# EAGLE design stm32f0-qfp32-devboard (EAGLE 9.6.2)
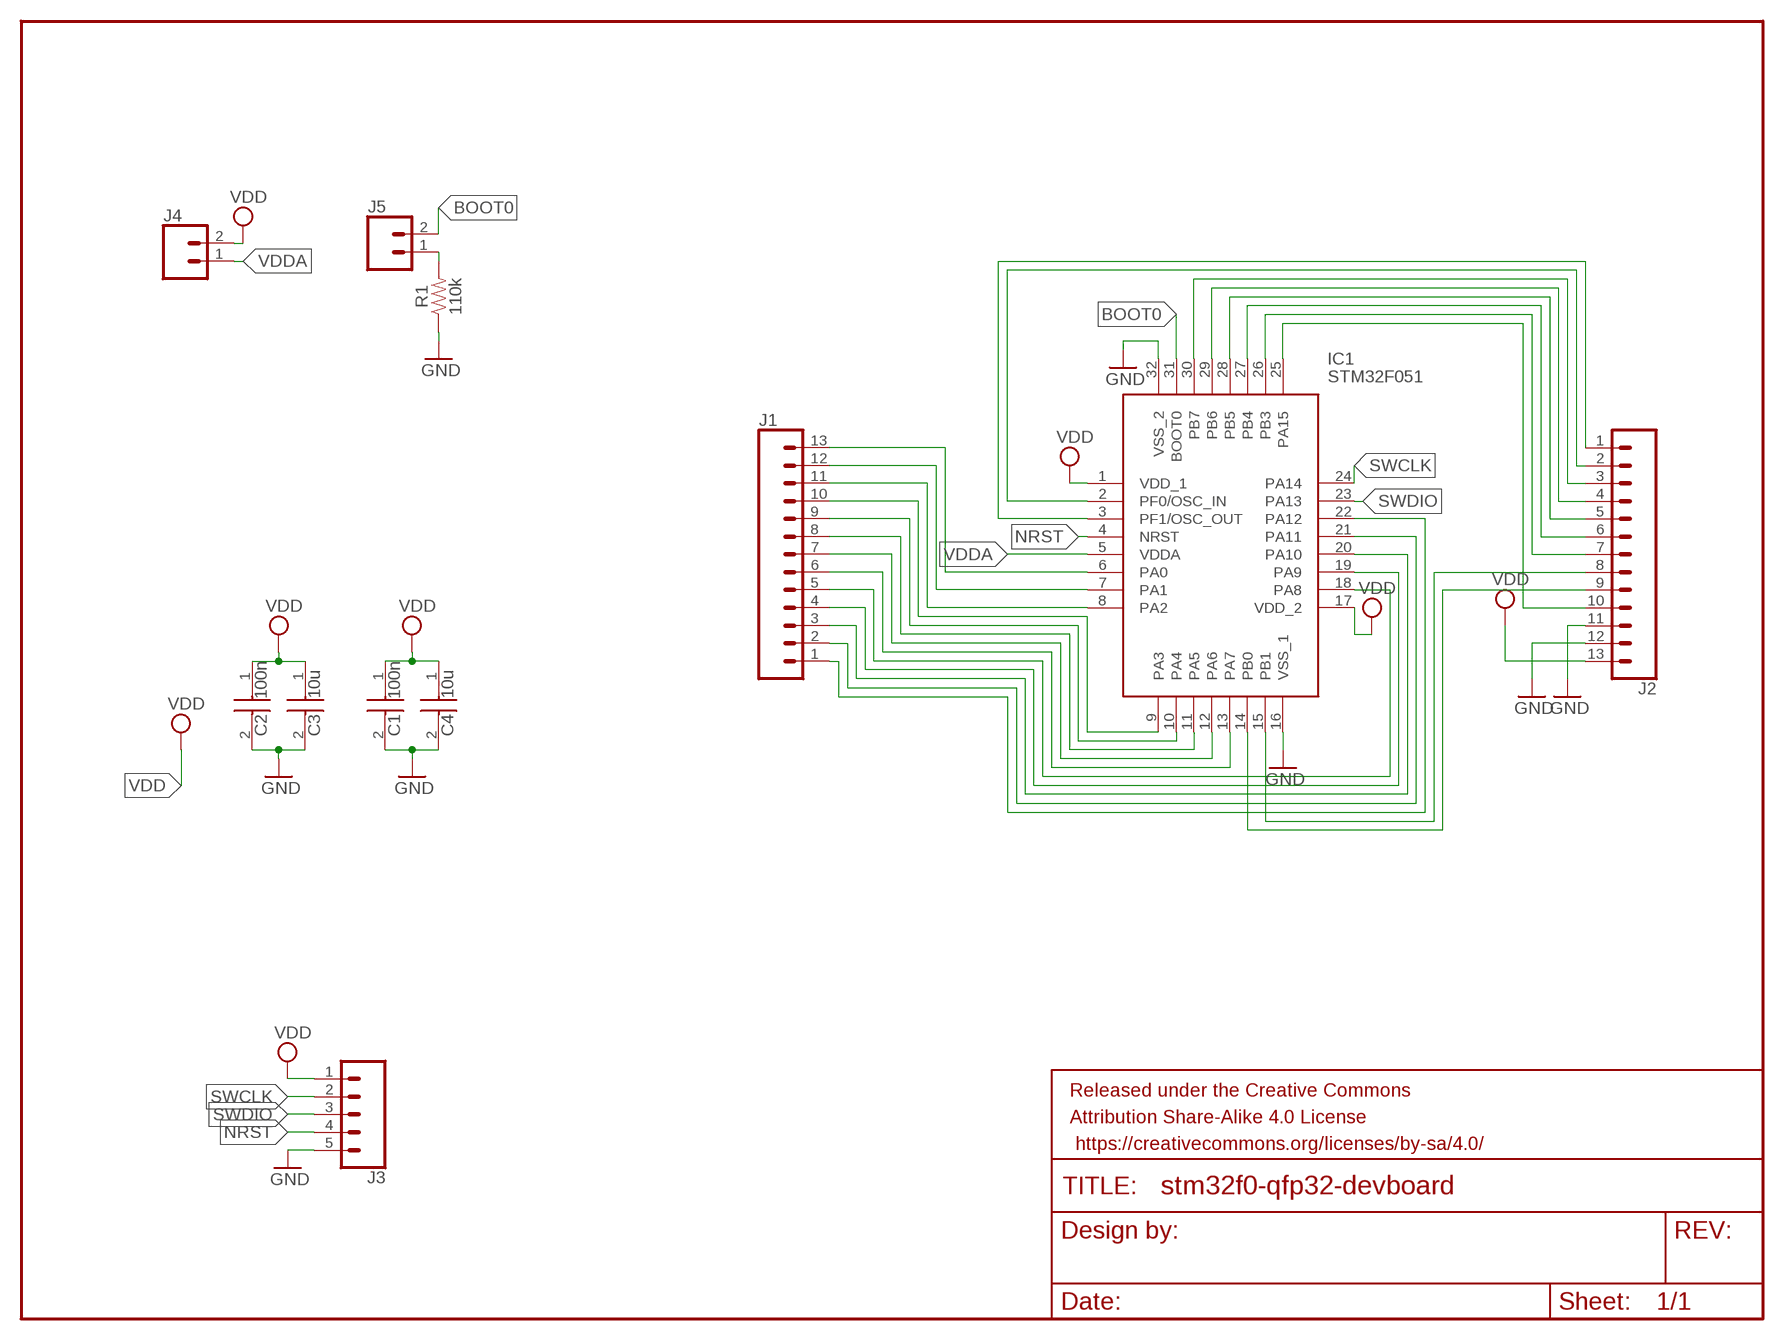
[diagram p0: schematic, sheet 1]

## Parts
C1  100n  C2012X7R1H104K085AA  [CAPC2012X100N]
C2  100n  C2012X7R1H104K085AA  [CAPC2012X100N]
C3  10u  C3216X7R1C106K160AC  [CAPC3216X180N]
C4  10u  C3216X7R1C106K160AC  [CAPC3216X180N]
FRAME2  FRAME-LETTERNO_PACKAGE  [DUMMY]
IC1  STM32F051  STM32F051K8T6  [QFP80P900X900X160-32N]
J1  CONN_13  [1X13]
J2  CONN_13  [1X13]
J3  CONN_05  [1X05]
J4  CONN_02  [1X02]
J5  CONN_02  [1X02]
R1  110k  0.22OHM-0805-1/4W-1%  [0805]

## Nets
BOOT0: IC1.31(BOOT0) J5.2
GND: C1.2 C2.2 C3.2 C4.2 IC1.16(VSS_1) IC1.32(VSS_2) J2.11 J2.12 J3.5 R1.1
N$1: IC1.6(PA0) J1.13
N$2: IC1.7(PA1) J1.12
N$3: IC1.2(PF0/OSC_IN) J2.2
N$4: IC1.3(PF1/OSC_OUT) J2.1
N$5: IC1.30(PB7) J2.3
N$6: IC1.29(PB6) J2.4
N$7: IC1.28(PB5) J2.5
N$8: IC1.27(PB4) J2.6
N$9: IC1.26(PB3) J2.7
N$10: IC1.15(PB1) J2.8
N$11: IC1.14(PB0) J2.9
N$12: IC1.8(PA2) J1.11
N$13: IC1.9(PA3) J1.10
N$14: IC1.10(PA4) J1.9
N$15: IC1.11(PA5) J1.8
N$16: IC1.12(PA6) J1.7
N$17: IC1.13(PA7) J1.6
N$18: IC1.18(PA8) J1.5
N$19: IC1.19(PA9) J1.4
N$20: IC1.20(PA10) J1.3
N$21: IC1.21(PA11) J1.2
N$22: IC1.22(PA12) J1.1
N$23: IC1.25(PA15) J2.10
N$24: J5.1 R1.2
NRST: IC1.4(NRST) J3.4
SWCLK: IC1.24(PA14) J3.2
SWDIO: IC1.23(PA13) J3.3
VDD: C1.1 C2.1 C3.1 C4.1 IC1.1(VDD_1) IC1.17(VDD_2) J2.13 J3.1 J4.2
VDDA: IC1.5(VDDA) J4.1

## Library data of the parts
C1 C2 = C2012X7R1H104K085AA-100n:C2012X7R1H104K085AA: TDK C2012 C 100nF Ceramic Multilayer Capacitor, 50 V dc, +125C, X7R Dielectric, +/-10% SMD Source: Datasheet; DESCRIPTION: TDK C2012 C 100nF Ceramic Multilayer Capacitor, 50 V dc, +125C, X7R Dielectric, +/-10% SMD; HEIGHT: 1mm; MANUFACTURER_NAME: TDK; MANUFACTURER_PART_NUMBER: C2012X7R1H104K085AA; MOUSER_PART_NUMBER: 810-C2012X7R1H104K-2; MOUSER_PRICE-STOCK: https://www.mouser.co.uk/ProductDetail/TDK/C2012X7R1H104K085AA?qs=LcTL%2F5vFEzHdxrAdosNnjw%3D%3D
C3 C4 = C3216X7R1C106K160AC-10u:C3216X7R1C106K160AC: 1206 X7R ceramic capacitor 16V 10uF TDK C3216 C 10uF Ceramic Multilayer Capacitor, 16 V dc X7R Dielectric +/-10% SMD Source: Datasheet <https://product.tdk.com/info/en/catalog/datasheets/mlcc_commercial_midvoltage_en.pdf>; DESCRIPTION: 1206 X7R ceramic capacitor 16V 10uF TDK C3216 C 10uF Ceramic Multilayer Capacitor, 16 V dc X7R Dielectric +/-10% SMD; HEIGHT: 1.8mm; MANUFACTURER_NAME: TDK; MANUFACTURER_PART_NUMBER: C3216X7R1C106K160AC; MOUSER_PART_NUMBER: 810-C3216X7R1C106K; MOUSER_PRICE-STOCK: https://www.mouser.co.uk/ProductDetail/TDK/C3216X7R1C106K160AC?qs=NRhsANhppD%252BpNpcA%252BnoX2A%3D%3D
FRAME2 = SparkFun-Aesthetics:FRAME-LETTER: Schematic Frame - Letter Standard 8.5x11 US Letter frame; DESIGNER: Nobody; VERSION: v01
IC1 = STM32F051:STM32F051K8T6: Source: Datasheet <http://www.st.com/web/en/resource/technical/document/datasheet/DM00039193.pdf>; HEIGHT: 1.6mm; MANUFACTURER_NAME: STMicroelectronics; MANUFACTURER_PART_NUMBER: STM32F051K8T6; MOUSER_PART_NUMBER: 511-STM32F051K8T6; MOUSER_PRICE-STOCK: https://www.mouser.co.uk/ProductDetail/STMicroelectronics/STM32F051K8T6?qs=gNDSiZmRJS8MM9puf%252Bb4Hg%3D%3D
J1 J2 = SparkFun-Connectors:CONN_13: Multi connection point. Often used as Generic Header-pin footprint for 0.1 inch spaced/style header connections On any of the 0.1 inch spaced packages, you can populate with these: Break Away Headers - Straight <https://www.sparkfun.com/products/116> (PRT-00116) Break Away Male Headers - Right Angle <https://www.sparkfun.com/products/553> (PRT-00553) Female Headers <https://www.sparkfun.com/products/115> (PRT-00115) Break Away Headers - Machine Pin <https://www.sparkfun.com/products/117> (PRT-00117) Break Away Female Headers - Swiss Machine Pin <https://www.sparkfun.com/products/743> (PRT-00743) For SCREWTERMINALS and SPRING TERMINALS visit here: Screw Terimnals on SparkFun.com <https://www.sparkfun.com/search/results?term=Screw+Terminals> (5mm/3.5mm/2.54mm spacing) This device is also useful as a general connection point to wire up your design to another part of your project. Our various solder wires solder well into these plated through hole pads. Hook-Up Wire - Assortment (Stranded, 22 AWG) <https://www.sparkfun.com/products/11375> (PRT-11375) Hook-Up Wire - Assortment (Solid Core, 22 AWG) <https://www.sparkfun.com/products/11367> (PRT-11367) View the entire wire category on our website here <https://www.sparkfun.com/categories/141> Special notes: Molex polarized connector foot print use with SKU : PRT-08231 with associated crimp pins and housings. 1MM SMD Version SKU: PRT-10208 NOTES ON THE VARIANTS LOCK and LOCK_LONGPADS... This footprint was designed to help hold the alignment of a through-hole component (i.e. 6-pin header) while soldering it into place. You may notice that each hole has been shifted either up or down by 0.005 of an inch from it's more standard position (which is a perfectly straight line). This slight alteration caused the pins (the squares in the middle) to touch the edges of the holes. Because they are alternating, it causes a "brace" to hold the component in place. 0.005 has proven to be the perfect amount of "off-center" position when using our standard breakaway headers. Although looks a little odd when you look at the bare footprint, once you have a header in there, the alteration is very hard to notice. Also,if you push a header all the way into place, it is covered up entirely on the bottom side.
J3 = SparkFun-Connectors:CONN_05: Multi connection point. Often used as Generic Header-pin footprint for 0.1 inch spaced/style header connections On any of the 0.1 inch spaced packages, you can populate with these: Break Away Headers - Straight <https://www.sparkfun.com/products/116> (PRT-00116) Break Away Male Headers - Right Angle <https://www.sparkfun.com/products/553> (PRT-00553) Female Headers <https://www.sparkfun.com/products/115> (PRT-00115) Break Away Headers - Machine Pin <https://www.sparkfun.com/products/117> (PRT-00117) Break Away Female Headers - Swiss Machine Pin <https://www.sparkfun.com/products/743> (PRT-00743) For SCREWTERMINALS and SPRING TERMINALS visit here: Screw Terimnals on SparkFun.com <https://www.sparkfun.com/search/results?term=Screw+Terminals> (5mm/3.5mm/2.54mm spacing) This device is also useful as a general connection point to wire up your design to another part of your project. Our various solder wires solder well into these plated through hole pads. Hook-Up Wire - Assortment (Stranded, 22 AWG) <https://www.sparkfun.com/products/11375> (PRT-11375) Hook-Up Wire - Assortment (Solid Core, 22 AWG) <https://www.sparkfun.com/products/11367> (PRT-11367) View the entire wire category on our website here <https://www.sparkfun.com/categories/141> Special notes: Molex polarized connector foot print use with SKU : PRT-08231 with associated crimp pins and housings. 1MM SMD Version SKU: PRT-10208
J4 J5 = SparkFun-Connectors:CONN_02: Multi connection point. Often used as Generic Header-pin footprint for 0.1 inch spaced/style header connections On any of the 0.1 inch spaced packages, you can populate with these: Break Away Headers - Straight <https://www.sparkfun.com/products/116> (PRT-00116) Break Away Male Headers - Right Angle <https://www.sparkfun.com/products/553> (PRT-00553) Female Headers <https://www.sparkfun.com/products/115> (PRT-00115) Break Away Headers - Machine Pin <https://www.sparkfun.com/products/117> (PRT-00117) Break Away Female Headers - Swiss Machine Pin <https://www.sparkfun.com/products/743> (PRT-00743) For SCREWTERMINALS and SPRING TERMINALS visit here: Screw Terimnals on SparkFun.com <https://www.sparkfun.com/search/results?term=Screw+Terminals> (5mm/3.5mm/2.54mm spacing) This device is also useful as a general connection point to wire up your design to another part of your project. Our various solder wires solder well into these plated through hole pads. Hook-Up Wire - Assortment (Stranded, 22 AWG) <https://www.sparkfun.com/products/11375> (PRT-11375) Hook-Up Wire - Assortment (Solid Core, 22 AWG) <https://www.sparkfun.com/products/11367> (PRT-11367) View the entire wire category on our website here <https://www.sparkfun.com/categories/141> Special notes: Molex polarized connector foot print use with: PRT-08233 with associated crimp pins and housings. 2.54_SCREWTERM for use with PRT-10571. 3.5mm Screw Terminal footprints for PRT-08084 5mm Screw Terminal footprints for use with PRT-08432
R1 = SparkFun-Resistors:0.22OHM: 0.22Ω resistor A resistor is a passive two-terminal electrical component that implements electrical resistance as a circuit element. Resistors act to reduce current flow, and, at the same time, act to lower voltage levels within circuits. - Wikipedia; PROD_ID: RES-09883; VALUE: 0.22

## Board
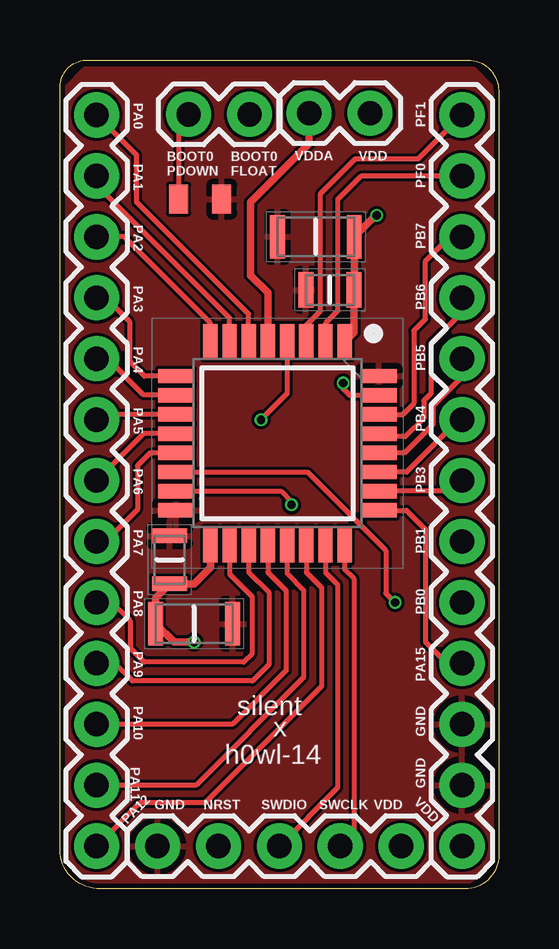
[diagram p1: board, top side]
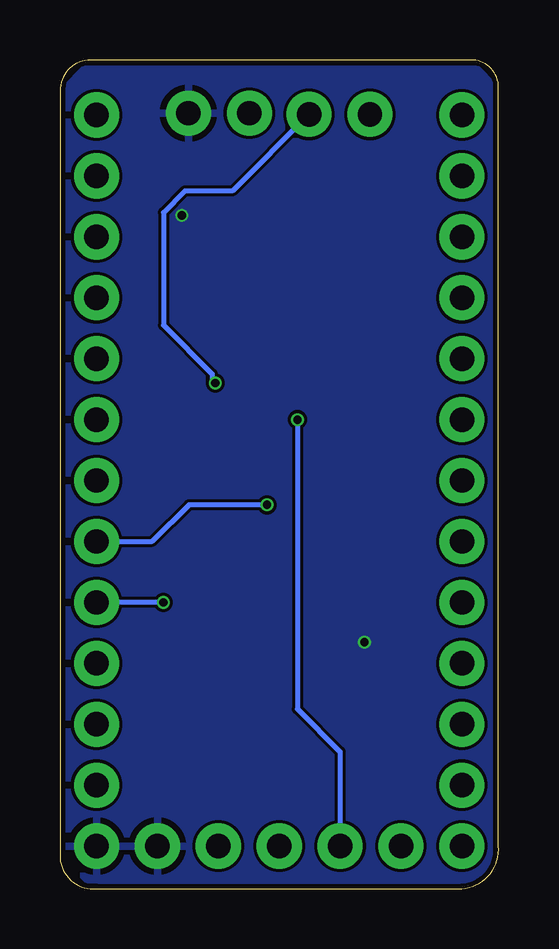
[diagram p2: board, bottom side, seen from below]

Size 18.29 x 34.56 mm. Coordinates in mm from the lower left corner, seen from the top.
Outline: 0,1.78 0,33.53 arc-90 1.27,34.55 17.02,34.55 arc-90 18.29,33.28 18.29,1.28 arc-90 16.77,0.01 1.53,0.01 arc-90 0,1.78
Copper layers (1*16): Top 0.035mm / dielectric 1.5mm / Bottom 0.035mm
Design rules "default *": minimum track width 5mil, minimum drill 12mil, track to track 5mil, track to pad 5mil, pad to pad 5mil, via to via 5mil, smd to smd 5mil, copper to edge 8mil, drill to drill 8mil, minimum pad ring 5mil, minimum via ring 3mil, stop-mask expansion 2.5mil, vias tented up to drill 0mil, thermal gap 10mil

### Footprints (pad centres in the part's own frame; a part is rotated, then mirrored left to right if it is on the bottom)
CAPC2012X100N = smd 0.62 x 1.47: 1 -1,0; 2 1,0
CAPC3216X180N = smd 0.62 x 1.82: 1 -1.6,0; 2 1.6,0
QFP80P900X900X160-32N = smd 1.475 x 0.6: 1 -4.238,2.8; 2 -4.238,2; 3 -4.238,1.2; 4 -4.238,0.4; 5 -4.238,-0.4; 6 -4.238,-1.2; 7 -4.238,-2; 8 -4.238,-2.8; 17 4.238,-2.8; 18 4.238,-2; 19 4.238,-1.2; 20 4.238,-0.4; 21 4.238,0.4; 22 4.238,1.2; 23 4.238,2; 24 4.238,2.8 | smd 0.6 x 1.475: 9 -2.8,-4.238; 10 -2,-4.238; 11 -1.2,-4.238; 12 -0.4,-4.238; 13 0.4,-4.238; 14 1.2,-4.238; 15 2,-4.238; 16 2.8,-4.238; 25 2.8,4.238; 26 2,4.238; 27 1.2,4.238; 28 0.4,4.238; 29 -0.4,4.238; 30 -1.2,4.238; 31 -2,4.238; 32 -2.8,4.238
1X13 = drill 1.016 pad 1.88: 1 0,0; 2 2.54,0; 3 5.08,0; 4 7.62,0; 5 10.16,0; 6 12.7,0; 7 15.24,0; 8 17.78,0; 9 20.32,0; 10 22.86,0; 11 25.4,0; 12 27.94,0; 13 30.48,0
1X05 = drill 1.016 pad 1.88: 1 0,0; 2 2.54,0; 3 5.08,0; 4 7.62,0; 5 10.16,0
1X02 = drill 1.016 pad 1.88: 1 0,0; 2 2.54,0
0805 = smd 0.8 x 1.2: 1 -0.9,0; 2 0.9,0

### Placement (x,y rotation side)
C1  11.26,24.97 180 top
C2  4.58,13.72 90 top
C3  10.67,27.18 180 top
C4  5.59,11.05 0 top
FRAME2  -0.76,-0.63 0 top
IC1  9.07,18.58 270 top
J1  1.53,1.78 90 top
J2  16.77,32.26 270 top
J3  14.23,1.78 180 top
J4  10.39,32.34 0 top
J5  5.36,32.29 0 top
R1  5.84,28.76 180 top

### Tracks (layer width: path | path; a pad name or v marks a point on that pad's centre or on a via)
BOOT0  (via drill 0.35)
  Top 0.203: v11.82,21.09 11.82,20.83 12.07,20.58 IC1.31
  Bottom 0.203: J5.2 11.1,29.09 13.09,29.09 13.97,28.2 13.97,23.5 11.94,21.47 11.94,21.21 v11.82,21.09
GND
  pour Top: 0.26,33.41 0.26,1.15 1.15,0.26 17.02,0.26 18.04,1.28 18.04,33.41 17.28,34.17 1.02,34.17
N$1
  Top 0.203: IC1.6 7.87,23.96 3.18,28.66 3.18,30.61 J1.13
N$2
  Top 0.203: IC1.7 7.07,23.8 1.53,29.34 J1.12
N$3
  Top 0.203: IC1.2 11.07,23.58 11.58,24.09 11.58,28.73 12.58,29.72 J2.2
N$4
  Top 0.203: IC1.3 10.27,23.5 10.87,24.09 10.87,28.99 12.31,30.43 14.94,30.43 J2.1
N$5
  Top 0.203: J2.3 16.26,27.18 15.24,26.17 15.24,23.75 14.76,23.27 14.76,20.24 14.3,19.78 IC1.30
N$6
  Top 0.203: J2.4 16.77,24.03 15.47,22.74 15.47,20.66 15.17,20.35 15.17,19.61 14.41,18.85 13.44,18.85 IC1.29
N$7
  Top 0.203: J2.5 16.77,21.34 15.55,20.12 15.55,19.36 14.37,18.18 IC1.28
N$8
  Top 0.203: J2.6 16.64,19.56 14.46,17.38 IC1.27
N$9
  Top 0.203: J2.7 16.32,16.58 IC1.26
N$10  (via drill 0.35)
  Top 0.203: IC1.15 9.21,16.58 9.66,16.13 v9.66,16.01
  Bottom 0.203: J2.8 14.44,14.48 12.92,16.01 v9.66,16.01
N$11  (via drill 0.35)
  Top 0.203: IC1.14 10.32,17.38 13.59,14.1 13.59,12.32 v13.97,11.94
  Bottom 0.203: v13.97,11.94 J2.9
N$12
  Top 0.203: IC1.8 6.27,23.58 2.67,27.18 J1.11
N$13
  Top 0.203: IC1.9 3.52,21.38 2.93,21.98 2.93,23.63 1.91,24.64 J1.10
N$14
  Top 0.203: IC1.10 4.82,20.6 3.5,20.6 1.99,22.1 J1.9
N$15
  Top 0.203: IC1.11 1.74,19.78 J1.8
N$16
  Top 0.203: IC1.12 3.48,18.98 J1.7
N$17
  Top 0.203: IC1.13 4.82,18.16 3.75,18.16 3.24,17.65 3.24,15.82 1.9,14.48 J1.6
N$18
  Top 0.203: IC1.18 7.07,13.13 8.01,12.2 8.01,9.78 7.68,9.45 3.51,9.45 2.93,10.04 2.93,11.18 2.16,11.94
  Top 0.305: J1.5 2.16,11.94
N$19
  Top 0.203: IC1.19 7.87,13.2 8.71,12.36 8.71,9.35 8.03,8.67 3.03,8.67 2.29,9.4 J1.4
N$20
  Top 0.203: IC1.20 8.67,13.2 9.44,12.44 9.44,9.11 7.19,6.86 J1.3
N$21
  Top 0.203: IC1.21 9.47,13.14 10.16,12.45 10.16,8.82 5.67,4.32 J1.2
N$22
  Top 0.203: IC1.22 10.27,13.2 10.91,12.56 10.91,8.45 6.05,3.59 3.33,3.59 J1.1
N$23
  Top 0.203: IC1.25 14.46,15.78 15.24,14.99 15.24,10.29 16.13,9.4 J2.10
N$24
  Top 0.203: J5.1 4.94,31.87 R1.2
NRST  (via drill 0.35)
  Top 0.203: v8.39,19.56 9.47,20.65 IC1.4
  Bottom 0.203: J3.4 6.61,5.72 8.39,7.5 v8.39,19.56
SWCLK
  Top 0.203: IC1.24 11.87,13.32 12.26,12.94 12.26,2.35 J3.2
SWDIO
  Top 0.203: J3.3 11.58,4.22 11.58,12.69 11.07,13.2 IC1.23
VDD  (via drill 0.35)
  Top 0.305: IC1.1 12.25,23.2 C1.1 12.27,24.99 C3.1 13.16,28.07 v13.21,28.07 | IC1.17 6.27,13.4 5.59,12.72 C2.1 3.99,12.14 C4.1 4.75,10.29 v5.59,10.29
  pour Bottom: 0.26,33.53 0.89,34.17 1.02,34.17 17.28,34.17 18.04,33.41 18.04,1.28 17.02,0.26 1.27,0.26 1.15,0.13 0.26,1.02 0.26,1.4
VDDA
  Top 0.305: IC1.5 8.67,24.85 7.95,25.58 7.95,28.62 10.39,31.07 J4.1

### Text on the board
tPlace: PA0 | PF1 | PA1 | BOOT0 / PDOWN | BOOT0 / FLOAT | VDDA | VDD | PF0 | PA2 | PB7 | PA3 | PB6 | PA4 | PB5 | PA5 | PB4 | PA6 | PB3 | PA7 | PB1 | PA8 | PB0 | PA9 | PA15 | PA10 | silent | x | GND | PA11 | h0wl-14 | VDD | GND | PA12 | GND | NRST | SWDIO | SWCLK | VDD